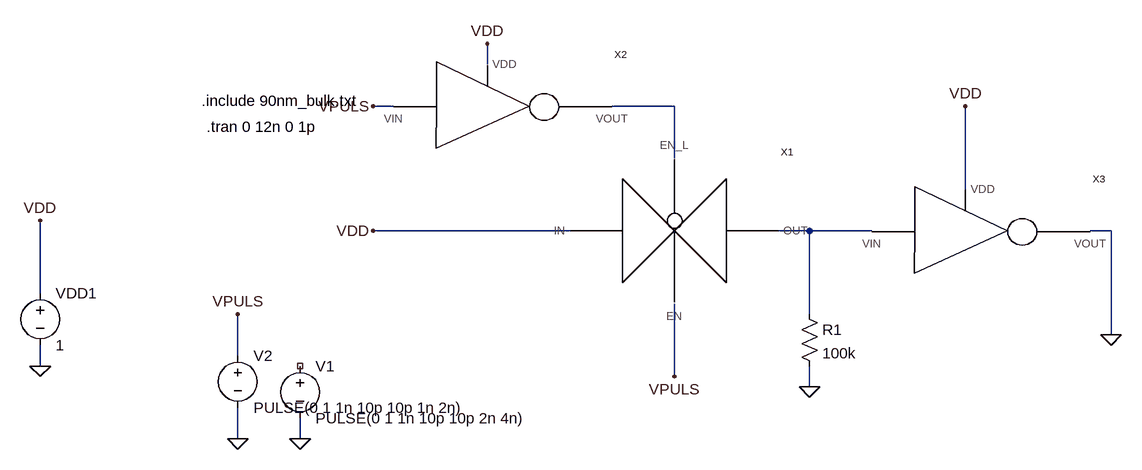
[diagram p0: schematic Draft5.asc]
Draft5.asc, the LTspice schematic file:
Version 4
SHEET 1 908 680
WIRE -240 -80 -240 -112
WIRE -384 -16 -416 -16
WIRE 16 -16 -48 -16
WIRE 48 -16 16 -16
WIRE 48 16 48 -16
WIRE 48 64 48 16
WIRE 496 112 496 -16
WIRE -304 176 -416 176
WIRE -240 176 -304 176
WIRE -208 176 -240 176
WIRE -112 176 -208 176
WIRE 256 176 208 176
WIRE 288 176 256 176
WIRE 352 176 288 176
WIRE 720 176 688 176
WIRE -928 272 -928 160
WIRE 256 304 256 176
WIRE 720 336 720 176
WIRE -624 368 -624 304
WIRE -928 384 -928 352
WIRE 48 400 48 288
WIRE 256 416 256 384
WIRE -624 496 -624 448
WIRE -528 496 -528 464
FLAG -928 160 VDD
FLAG -928 384 0
FLAG -624 496 0
FLAG -528 496 0
FLAG -416 176 VDD
FLAG -624 304 VPULS
FLAG -240 -112 VDD
FLAG -416 -16 VPULS
FLAG 48 400 VPULS
FLAG 496 -16 VDD
FLAG 720 336 0
FLAG 256 416 0
DATAFLAG -240 176 ""
DATAFLAG -208 176 ""
DATAFLAG -304 176 ""
DATAFLAG 288 176 ""
DATAFLAG -208 176 ""
DATAFLAG 256 176 ""
DATAFLAG 16 -16 ""
DATAFLAG 48 16 ""
SYMBOL voltage -928 256 R0
WINDOW 123 0 0 Left 2
WINDOW 39 0 0 Left 2
SYMATTR InstName VDD1
SYMATTR Value 1
SYMBOL voltage -624 352 R0
WINDOW 123 0 0 Left 2
WINDOW 39 0 0 Left 2
SYMATTR InstName V2
SYMATTR Value PULSE(0 1 1n 10p 10p 1n 2n)
SYMBOL voltage -528 368 R0
WINDOW 123 0 0 Left 2
WINDOW 39 0 0 Left 2
SYMATTR InstName V1
SYMATTR Value PULSE(0 1 1n 10p 10p 2n 4n)
SYMBOL tg 48 176 R0
SYMATTR InstName X1
SYMBOL inverter -256 -16 R0
SYMATTR InstName X2
SYMBOL inverter 480 176 R0
SYMATTR InstName X3
SYMBOL res 240 288 R0
SYMATTR InstName R1
SYMATTR Value 100k
TEXT -672 16 Left 2 !.tran 0 12n 0 1p
TEXT -680 -24 Left 2 !.include 90nm_bulk.txt

The netlist it stands for:
* Draft5.asc
VDD1 VDD 0 1
V2 VPULS 0 PULSE(0 1 1n 10p 10p 1n 2n)
V1 NC_01 0 PULSE(0 1 1n 10p 10p 2n 4n)
XX1 VDD N002 N001 VPULS tg  ; pins IN OUT EN_L EN
XX2 VPULS N001 VDD inverter  ; pins VIN VOUT VDD
XX3 N002 0 VDD inverter  ; pins VIN VOUT VDD
R1 N002 0 100k
.tran 0 12n 0 1p
.include 90nm_bulk.txt
.backanno
.end